# Altium project 24V-20A-Power-Board-v1.0.PrjPcb (part 2 of 5)
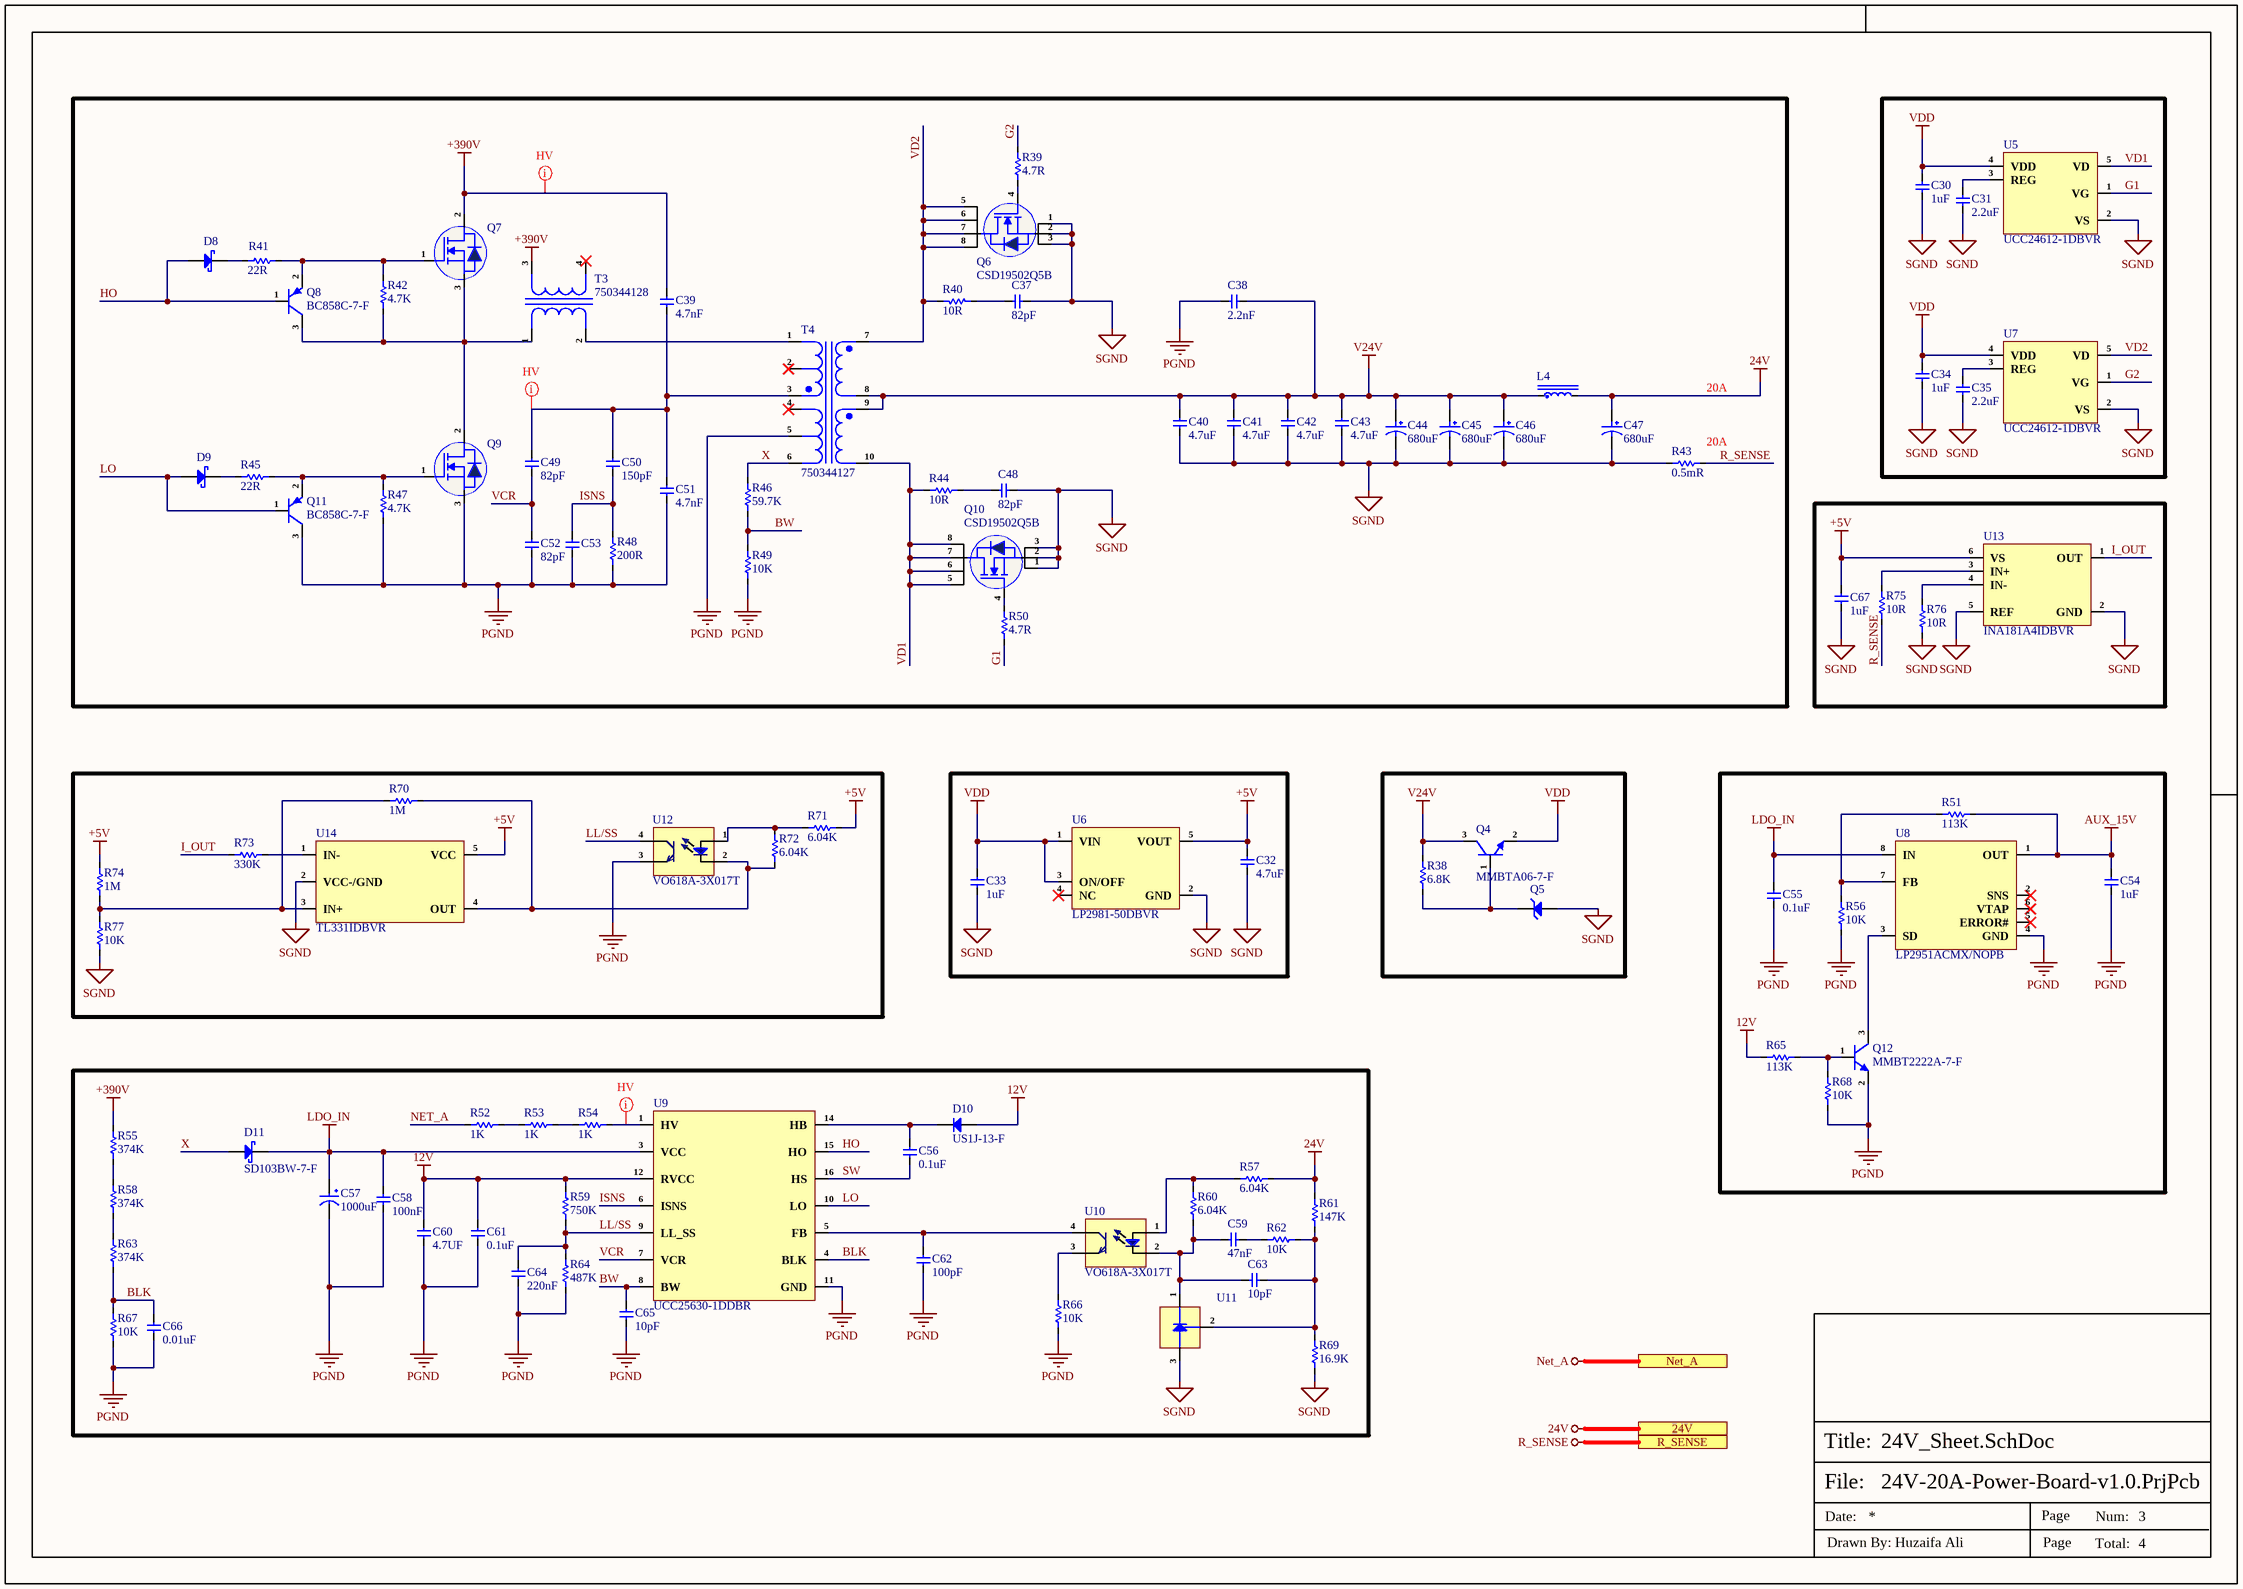
[diagram p4: 24V_Sheet.SchDoc]

## Sheet 24V_Sheet.SchDoc (continued)
### Library data of the parts
C30 C33 C34 C54 C67 = TCC0603X5R105M250CT: 1uF 25V X5R ±20% 0603 Multilayer Ceramic Capacitors MLCC - SMD/SMT ROHS; Manufacturer: CCTC; LCSC Part Number: C6266891; Manufacturer Part Number: TCC0603X5R105M250CT; Value: 1uF; Item Type: Capacitor; ComponentLink1Description: LCSC; ComponentLink1URL: https://www.lcsc.com/product-detail/Multilayer-Ceramic-Capacitors-MLCC-SMD-SMT_CCTC-TCC0603X5R105M250CT_C6266891.html
C31 C35 = GRM188R6YA225KA12D: CAP, 2.2µF, 35V, 10%, X5R, 0603; Manufacturer: Murata; Material: Ceramic; Item Type: Capacitor; Supplier 1: Digi-Key; Manufacturer Part Number: GRM188R6YA225KA12D; RoHS: Yes; Category: Ceramic Capacitors; Stock 1: 81665; Pricing 1: 1=0.21000, 10=0.14100, 50=0.08480, 100=0.07170, 500=0.04904, 1000=0.04338 (USD); Mount: Surface Mount; Case/Package: 0603; Case Code (Metric): 1608; Case Code (Imperial): 0603; Weight: 0.000222oz; Min Operating Temperature: -55°C; Max Operating Temperature: 85°C; Package Quantity: 4000; Packaging: Tape and Reel; Capacitance: 2.2uF; Tolerance: 10%; Voltage Rating: 35V; Dielectric: X5R; Voltage: 35V; Termination: SMD/SMT; Voltage Rating (DC): 35V; Series: GRM; Length: 1.6mm; Width: 0.8mm; Height: 0.8mm; Thickness: 0.035inch; Depth: 0.8mm; REACH SVHC: No SVHC; Lead Free: Lead Free; RoHS Compliant: Yes; ComponentLink1URL: https://datasheet.ciiva.com/14906/partnumbering-e-01-14906490.pdf?src-supplier=Digi-Key; ComponentLink1Description: https://datasheet.ciiva.com/14906/partnumbering-e-01-14906490.pdf?src-supplier=Digi-Key; ComponentLink2URL: https://datasheet.ciiva.com/14906/partnumbering-e-01-14906491.pdf?src-supplier=Digi-Key; ComponentLink2Description: https://datasheet.ciiva.com/14906/partnumbering-e-01-14906491.pdf?src-supplier=Digi-Key; ComponentLink3URL: https://datasheet.ciiva.com/14906/partnumbering-e-01-14906492.pdf?src-supplier=Digi-Key; ComponentLink3Description: https://datasheet.ciiva.com/14906/partnumbering-e-01-14906492.pdf?src-supplier=Digi-Key; Supplier Part Number 1: 490-7204-1-ND; LCSC Part Number: C86017
C32 = CC0603KRX5R7BB475: CAP CER 4.7UF 16V X5R 0603; Manufacturer: Yageo; Tolerance: 10%; Item Type: Capacitor; Supplier 1: Digi-Key; Manufacturer Part Number: CC0603KRX5R7BB475; RoHS: Yes; Category: Ceramic Capacitors; Stock 1: 547703; Pricing 1: 1=0.20000, 10=0.13800, 50=0.08280, 100=0.06990, 500=0.04784, 1000=0.04233 (USD); Mount: Surface Mount; Case/Package: 0603; Case Code (Imperial): 0603; Case Code (Metric): 1608; Weight: 7.1E-05oz; Min Operating Temperature: -55°C; Max Operating Temperature: 85°C; Capacitance: 4.7uF; Voltage Rating: 16V; Voltage Rating (DC): 16V; Packaging: Tape and Reel; Dielectric: X5R; Termination: SMD/SMT; Resistor Type: Ceramic; Series: CC; Length: 1.6mm; Width: 0.8mm; Height: 0.8mm; Thickness: 0.037inch; Depth: 0.8mm; Lead Free: Lead Free; Halogen Free: Halogen Free; RoHS Compliant: Yes; ComponentLink1URL: http://www.mouser.com/ds/2/447/UPY-GPHC_X5R_4V-to-50V_25-1131599.pdf?src-supplier=Mouser; ComponentLink1Description: http://www.mouser.com/ds/2/447/UPY-GPHC_X5R_4V-to-50V_25-1131599.pdf?src-supplier=Mouser; ComponentLink2URL: http://www.yageo.com/documents/recent/UPY-GPHC_X5R_4V-to-50V_25.pdf?src-supplier=Digi-Key; ComponentLink2Description: http://www.yageo.com/documents/recent/UPY-GPHC_X5R_4V-to-50V_25.pdf?src-supplier=Digi-Key; Supplier Part Number 1: 311-1785-1-ND; LCSC Part Number: C277476
C37 C48 C49 C52 = GCM31A7U3A820JX01D: CAP CER 82PF 1KV U2J 1206; Manufacturer: Murata; Item Type: Capacitors; Supplier: Digikey; LCSC Part Number: C5125804; Manufacturer Part Number: GCM31A7U3A820JX01D; RoHS: Yes; Pricing: 4000=0.07144 (USD)
C38 = KJKF222M2FF7035A075E: 2.2nF ±20% Y2 300V Plugin,P=7.5mm Safety Capacitors ROHS; Manufacturer: KNSCHA; Supplier: LCSC; LCSC Part Number: C2803195; Manufacturer Part Number: KJKF222M2FF7035A075E; RoHS: No; Item Type: Capacitor
C39 C51 = MMK472J3AC2KN206G0: 4.7nF -40℃~+105℃ ±5% 1kV Plugin,P=10mm Polypropylene Film Capacitors (CBB) ROHS; Manufacturer: KNSCHA; Manufacturer Part Number: MMK472J3AC2KN206G0; Package: Plugin,P=10mm; LCSC Part Number: C2998032; Item Type: Capacitor; ComponentLink1Description: LCSC; ComponentLink1URL: https://www.lcsc.com/product-detail/Polypropylene-Film-Capacitors-CBB_KNSCHA-MMK472J3AC2KN206G0_C2998032.html
C40-C43 = GRM31CC72A475KE11L: CAP CER 4.7UF 100V X7S 1206; Manufacturer: Murata; Item Type: Capacitor; Supplier 1: Arrow Electronics; Manufacturer Part Number: GRM31CC72A475KE11L; RoHS: Yes; Category: Ceramic Capacitors; Stock 1: 120000; Pricing 1: 2000=0.23470, 4000=0.21710, 10000=0.21040, 14000=0.20560 (USD); RoHS Compliant: Yes; ComponentLink1URL: https://search.murata.co.jp/Ceramy/image/img/A01X/G101/ENG/GRM31CC72A475KE11-01A.pdf?src-supplier=Digi-Key; ComponentLink1Description: https://search.murata.co.jp/Ceramy/image/img/A01X/G101/ENG/GRM31CC72A475KE11-01A.pdf?src-supplier=Digi-Key; Supplier Part Number 1: GRM31CC72A475KE11L; LCSC Part Number: C237304
C44-C47 = ERS1HM681W20OT: 680uF 50V ±20% Plugin,D12.5xL20mm Aluminum Electrolytic Capacitors - Leaded ROHS; Manufacturer: AISHI; Manufacturer Part Number: ERS1HM681W20OT; Package: Plugin,D12.5xL20mm; LCSC Part Number: C106668; Item Type: Capacitor; ComponentLink1Description: LCSC; ComponentLink1URL: https://www.lcsc.com/product-detail/Aluminum-Electrolytic-Capacitors-Leaded_AISHI-Aihua-Group-ERS1HM681W20OT_C106668.html
C50 = GRM31A7U3A151JW31D: CAP CER 150PF 1KV U2J 1206; Manufacturer: Murata; Item Type: Capacitors; Temperature Coefficient: -750ppm/°C; Supplier: Mouser; LCSC Part Number: C162467; Manufacturer Part Number: GRM31A7U3A151JW31D; RoHS: Yes; Stock: 15950; Pricing: 1=0.39, 10=0.191, 50=0.191, 100=0.123, 1000=0.098, 10000=0.085 (USD); ComponentLink1URL: https://datasheet.ciiva.com/16214/product-16214766.pdf?src-supplier=Future+Electronics; ComponentLink1Description: https://datasheet.ciiva.com/16214/product-16214766.pdf?src-supplier=Future+Electronics; ComponentLink2URL: https://datasheet.ciiva.com/139/partnumbering-e-01-139260.pdf?src-supplier=Digikey; ComponentLink2Description: https://datasheet.ciiva.com/139/partnumbering-e-01-139260.pdf?src-supplier=Digikey; ComponentLink3URL: https://datasheet.ciiva.com/139/partnumbering-e-01-139261.pdf?src-supplier=Digikey; ComponentLink3Description: https://datasheet.ciiva.com/139/partnumbering-e-01-139261.pdf?src-supplier=Digikey; ComponentLink4URL: https://datasheet.ciiva.com/139/partnumbering-e-01-139262.pdf?src-supplier=Digikey; ComponentLink4Description: https://datasheet.ciiva.com/139/partnumbering-e-01-139262.pdf?src-supplier=Digikey
C53 = RF15N3R3C500CT: CAP CER 3.3PF 50V C0G/NP0 0402; Manufacturer: Walsin Tech Corp; Item Type: Capacitor; Manufacturer Part Number: RF15N3R3C500CT; Package: 0402; LCSC Part Number: C172822; ComponentLink1Description: LCSC; ComponentLink1URL: https://www.lcsc.com/product-detail/Multilayer-Ceramic-Capacitors-MLCC-SMD-SMT_Walsin-Tech-Corp-RF15N3R3C500CT_C172822.html
C55 = GRM31C5C1H104FA01L: 50V 100nF C0G ±1% 1206 Multilayer Ceramic Capacitors MLCC - SMD/SMT ROHS; Manufacturer: Murata Electronics; LCSC Part Number: C2981728; Item Type: Capacitor; Manufacturer Part Number: GRM31C5C1H104FA01L; ComponentLink1Description: LCSC; ComponentLink1URL: https://www.lcsc.com/product-detail/Multilayer-Ceramic-Capacitors-MLCC-SMD-SMT_Murata-Electronics-GRM31C5C1H104FA01L_C2981728.html
C56 C61 = CC0805KKX7R0BB104: CAP CER 0.1UF 100V X7R 0805; Manufacturer: Yageo; Item Type: Capacitor; Tolerance: 10%; Value: 100nF; Supplier: Digikey; LCSC Part Number: C106243; Manufacturer Part Number: CC0805KKX7R0BB104; RoHS: Yes; Stock: 52345; Pricing: 1=0.19, 10=0.126, 50=0.0756, 100=0.0594, 500=0.0439, 1000=0.03634 (USD); Mounting Technology: Surface Mount; Case/Package: 0805; Case Code (Imperial): 0805; Case Code (Metric): 2012; Weight: 0.000194oz; Min Operating Temperature: -55°C; Max Operating Temperature: 125°C; Dielectric: X7R; Packaging: Tape and Reel; Voltage Rating (DC): 100V; Voltage Rating: 100V; Termination: SMD/SMT; Voltage: 100V; Series: CC; Lead Free: Lead Free; RoHS Compliant: Yes; ComponentLink1URL: https://media.digikey.com/pdf/Data%20Sheets/Yageo%20PDFs/NPO,%20X7R%20Mid-voltage.pdf?src-supplier=Digikey; ComponentLink1Description: https://media.digikey.com/pdf/Data%20Sheets/Yageo%20PDFs/NPO,%20X7R%20Mid-voltage.pdf?src-supplier=Digikey; ComponentLink2URL: http://www.mouser.com/ds/2/447/Yageo_UPY-GP_NP0_16V-to-50V_9-358835.pdf?src-supplier=Mouser; ComponentLink2Description: http://www.mouser.com/ds/2/447/Yageo_UPY-GP_NP0_16V-to-50V_9-358835.pdf?src-supplier=Mouser; ComponentLink3URL: http://www.yageo.com/documents/recent/UPY-NP0X7R_MV_100-to-630V_21.pdf?src-supplier=Digikey; ComponentLink3Description: http://www.yageo.com/documents/recent/UPY-NP0X7R_MV_100-to-630V_21.pdf?src-supplier=Digikey; ComponentLink4URL: https://datasheet.octopart.com/CC0805KKX7R0BB104-Yageo-datasheet-101324229.pdf?src-supplier=Newark; ComponentLink4Description: https://datasheet.octopart.com/CC0805KKX7R0BB104-Yageo-datasheet-101324229.pdf?src-supplier=Newark; ComponentLink5URL: https://datasheet.octopart.com/CC0805KKX7R0BB104-Yageo-datasheet-166511530.pdf?src-supplier=Future+Electronics; ComponentLink5Description: https://datasheet.octopart.com/CC0805KKX7R0BB104-Yageo-datasheet-166511530.pdf?src-supplier=Future+Electronics
C57 = VZH102M1HTR-1616CS: 1000uF 50V ±20% SMD,D16xL16.5mm Aluminum Electrolytic Capacitors - SMD ROHS; Manufacturer: Surge Components; Supplier: Future Electronics; LCSC Part Number: C5266058; Manufacturer Part Number: VZH102M1HTR-1616CS; RoHS: No; Stock: 600; Pricing: 200=0.675, 600=0.645, 800=0.64, 2000=0.62, 3000=0.6 (USD); Item Type: Capacitors
C58 = CC0603KRX5R9BB104: CAP CER 0.1UF 50V X5R 0603; Manufacturer: Yageo; Tolerance: 10%; Item Type: Capacitor; Supplier 1: Digi-Key; Manufacturer Part Number: CC0603KRX5R9BB104; RoHS: Yes; Category: Ceramic Capacitors; Stock 1: 152253; Pricing 1: 1=0.10000, 10=0.05200, 50=0.02820, 100=0.02310, 500=0.01648, 1000=0.01294 (USD); Mount: Surface Mount; Case/Package: 0603; Case Code (Imperial): 0603; Case Code (Metric): 1608; Weight: 7.1E-05oz; Min Operating Temperature: -55°C; Max Operating Temperature: 85°C; Capacitance: 100nF; Packaging: Tape and Reel; Voltage Rating: 50V; Dielectric: X5R; Termination: SMD/SMT; Voltage Rating (DC): 50V; Package Quantity: 4000; Length: 0.063inch; Width: 0.031inch; Thickness: 0.035inch; Lead Free: Lead Free; Halogen Free: Halogen Free; ComponentLink1URL: http://www.mouser.com/ds/2/447/Yageo_UPY-GP_NP0_16V-to-50V_9-358835.pdf?src-supplier=Mouser; ComponentLink1Description: http://www.mouser.com/ds/2/447/Yageo_UPY-GP_NP0_16V-to-50V_9-358835.pdf?src-supplier=Mouser; ComponentLink2URL: https://www.yageo.com/upload/media/product/productsearch/datasheet/mlcc/UPY-GPHC_X5R_4V-to-50V_26.pdf?src-supplier=Digi-Key; ComponentLink2Description: https://www.yageo.com/upload/media/product/productsearch/datasheet/mlcc/UPY-GPHC_X5R_4V-to-50V_26.pdf?src-supplier=Digi-Key; ComponentLink3URL: http://www.yageo.com/exep/pages/download/literatures/ProductSelectionGuide%202014_Final_2.pdf?src-supplier=Digi-Key; ComponentLink3Description: http://www.yageo.com/exep/pages/download/literatures/ProductSelectionGuide%202014_Final_2.pdf?src-supplier=Digi-Key; Supplier Part Number 1: 311-4046-1-ND; LCSC Part Number: C110022
C59 = GRM155R71E473KA88D: CAP CER 0.047UF 25V X7R 0402; Manufacturer: Murata; Material: Ceramic; Tolerance: 10%; Item Type: Capacitor; Supplier 1: Rs; Manufacturer Part Number: GRM155R71E473KA88D; RoHS: Yes; Category: Ceramic Capacitors; Stock 1: 10000; Pricing 1: 1000=0.00007, 8000=0.00900 (GBP); Mounting Technology: Surface Mount; Case/Package: 0402; Pins: 2; Case Code (Metric): 1005; Case Code (Imperial): 0402; Min Operating Temperature: -55°C; Max Operating Temperature: 125°C; Value: 47nF; Dielectric: X7R; Package Quantity: 1; Voltage Rating: 25V; Packaging: Tape and Reel; Termination: SMD/SMT; Voltage: 25V; Voltage Rating (DC): 25V; Series: GRM; Construction: Flat; Length: 1mm; Width: 0.02inch; Height: 0.5mm; Thickness: 0.022inch; Depth: 0.5mm; Radiation Hardening: No; Reach SVHC Compliant: Yes; Lead Free: Lead Free; RoHS Compliant: Yes; ComponentLink1URL: https://datasheet.ciiva.com/34302/1856425-34302854.pdf?src-supplier=Jameco; ComponentLink1Description: https://datasheet.ciiva.com/34302/1856425-34302854.pdf?src-supplier=Jameco; ComponentLink2URL: https://datasheet.ciiva.com/131/grm155r71e473ka88-01-131494.pdf?src-supplier=Digi-Key; ComponentLink2Description: https://datasheet.ciiva.com/131/grm155r71e473ka88-01-131494.pdf?src-supplier=Digi-Key; ComponentLink3URL: https://datasheet.ciiva.com/18184/getdatasheetpartid-153136-18184712.pdf?src-supplier=Verical; ComponentLink3Description: https://datasheet.ciiva.com/18184/getdatasheetpartid-153136-18184712.pdf?src-supplier=Verical; ComponentLink4URL: https://datasheet.ciiva.com/29199/454180-da-01-en-vs-kondensator-0402-29199826.pdf?src-supplier=Conrad; ComponentLink4Description: https://datasheet.ciiva.com/29199/454180-da-01-en-vs-kondensator-0402-29199826.pdf?src-supplier=Conrad; ComponentLink5URL: https://datasheet.ciiva.com/14103/grmseries-highdielectrictype-eng-14103754.pdf?src-supplier=Distrelec; ComponentLink5Description: https://datasheet.ciiva.com/14103/grmseries-highdielectrictype-eng-14103754.pdf?src-supplier=Distrelec; ComponentLink6URL: https://datasheet.ciiva.com/7937/608985-7937623.pdf?src-supplier=Element14; ComponentLink6Description: https://datasheet.ciiva.com/7937/608985-7937623.pdf?src-supplier=Element14; ComponentLink7URL: https://datasheet.ciiva.com/131/grm155r71e473ka88-01-131493.pdf?src-supplier=Digi-Key; ComponentLink7Description: https://datasheet.ciiva.com/131/grm155r71e473ka88-01-131493.pdf?src-supplier=Digi-Key; ComponentLink8URL: https://datasheet.ciiva.com/131/grm155r71e473ka88-01-131492.pdf?src-supplier=Digi-Key; ComponentLink8Description: https://datasheet.ciiva.com/131/grm155r71e473ka88-01-131492.pdf?src-supplier=Digi-Key; ComponentLink9URL: https://datasheet.ciiva.com/5424/product-5424844.pdf?src-supplier=Mouser; ComponentLink9Description: https://datasheet.ciiva.com/5424/product-5424844.pdf?src-supplier=Mouser; ComponentLink10URL: https://datasheet.ciiva.com/2989/product-2989395.pdf?src-supplier=Avnet; ComponentLink10Description: https://datasheet.ciiva.com/2989/product-2989395.pdf?src-supplier=Avnet; ComponentLink11URL: https://datasheet.ciiva.com/16213/product-16213823.pdf?src-supplier=Future+Electronics; ComponentLink11Description: https://datasheet.ciiva.com/16213/product-16213823.pdf?src-supplier=Future+Electronics; Supplier Part Number 1: 2478015P; LCSC Part Number: C77017
C60 = CL10A475KA8NQNC: CAP CER 4.7UF 25V X5R 0603; Manufacturer: Samsung; Tolerance: 10%; Supplier 1: Digi-Key; Manufacturer Part Number: CL10A475KA8NQNC; Stock 1: 2252340; Pricing 1: 1=0.37, 10=0.255, 100=0.1528, 500=0.11456, 1000=0.09675 (USD); Mount: Surface Mount; Case/Package: 0603; Case Code (Metric): 1608; Case Code (Imperial): 0603; Contact Plating: Tin; Min Operating Temperature: -55°C; Max Operating Temperature: 85°C; Package Quantity: 1; Packaging: Tape and Reel; Capacitance: 4.7uF; Voltage Rating: 25V; Dielectric: X5R; Termination: Wraparound; Length: 1.6mm; Width: 0.031inch; Thickness: 0.035inch; Depth: 0.8mm; Lead Free: Lead Free; ComponentLink1URL: http://www.samsungsem.com/kr/support/product-search/mlcc/CL10A475KA8NQNC.jsp?src-supplier=Digi-Key; ComponentLink1Description: http://www.samsungsem.com/kr/support/product-search/mlcc/CL10A475KA8NQNC.jsp?src-supplier=Digi-Key; Supplier Part Number 1: 1276-1900-1-ND; LCSC Part Number: C69335
C62 = CC0603JRNPO9BN101: CAP CER 100PF 50V C0G/NPO 0603; Manufacturer: Yageo; Tolerance: 5%; Dielectric: C0G; Temperature Coefficient: 30ppm/°C; Insulation Resistance: 100GR; Supplier 1: Arrow Electronics; Manufacturer Part Number: CC0603JRNPO9BN101; RoHS: Yes; Category: Ceramic Capacitors; Stock 1: 10744; Pricing 1: 1=0.06030, 10=0.04400, 25=0.02170, 100=0.01580, 250=0.01330, 500=0.01300, 1000=0.01150, 3000=0.01010, 6000=0.00680 (USD); Mount: Surface Mount; Case/Package: 0603; Number of Pins: 2; Case Code (Imperial): 0603; Case Code (Metric): 1608; Min Operating Temperature: -55°C; Max Operating Temperature: 125°C; Capacitance: 100pF; Voltage: 50V; Voltage Rating: 50V; Voltage Rating (DC): 50V; Packaging: Tape and Reel; Package Quantity: 1; Termination: SMD/SMT; Resistor Type: Ceramic; Series: CC; Length: 1.6mm; Width: 0.8mm; Height: 0.8mm; Thickness: 0.035inch; Depth: 0.8mm; Radiation Hardening: No; RoHS Compliant: Yes; REACH SVHC: Unknown; Lead Free: Lead Free; ComponentLink1URL: https://datasheet.ciiva.com/11786/0900766b8079c870-11786060.pdf?src-supplier=RSComponents; ComponentLink1Description: https://datasheet.ciiva.com/11786/0900766b8079c870-11786060.pdf?src-supplier=RSComponents; ComponentLink2URL: https://datasheet.ciiva.com/7978/1443161-7978127.pdf?src-supplier=Element14; ComponentLink2Description: https://datasheet.ciiva.com/7978/1443161-7978127.pdf?src-supplier=Element14; ComponentLink3URL: https://datasheet.ciiva.com/28450/1443161-28450457.pdf?src-supplier=Element14; ComponentLink3Description: https://datasheet.ciiva.com/28450/1443161-28450457.pdf?src-supplier=Element14; ComponentLink4URL: https://datasheet.ciiva.com/46430/1835847-46430151.pdf?src-supplier=Element14; ComponentLink4Description: https://datasheet.ciiva.com/46430/1835847-46430151.pdf?src-supplier=Element14; ComponentLink5URL: https://datasheet.ciiva.com/144/mlccorderingcode-144629.pdf?src-supplier=Digi-Key; ComponentLink5Description: https://datasheet.ciiva.com/144/mlccorderingcode-144629.pdf?src-supplier=Digi-Key; ComponentLink6URL: https://datasheet.ciiva.com/144/mlccorderingcode-144628.pdf?src-supplier=Digi-Key; ComponentLink6Description: https://datasheet.ciiva.com/144/mlccorderingcode-144628.pdf?src-supplier=Digi-Key; ComponentLink7URL: https://datasheet.ciiva.com/144/mlccorderingcode-144630.pdf?src-supplier=Digi-Key; ComponentLink7Description: https://datasheet.ciiva.com/144/mlccorderingcode-144630.pdf?src-supplier=Digi-Key; ComponentLink8URL: https://datasheet.ciiva.com/11464/upy-gp-np0-16v-to-50v-8-11464725.pdf?src-supplier=Avnet; ComponentLink8Description: https://datasheet.ciiva.com/11464/upy-gp-np0-16v-to-50v-8-11464725.pdf?src-supplier=Avnet; ComponentLink9URL: https://datasheet.ciiva.com/26829/getdatasheetpartid-403525-26829372.pdf?src-supplier=Verical; ComponentLink9Description: https://datasheet.ciiva.com/26829/getdatasheetpartid-403525-26829372.pdf?src-supplier=Verical; Supplier Part Number 1: CC0603JRNPO9BN101; LCSC Part Number: C14665
C63 C65 = CC0603JRNPO9BN100: CAP CER 10PF 50V C0G/NPO 0603; Manufacturer: Yageo; Tolerance: 5%; Dielectric: C0G; Temperature Coefficient: 30ppm/°C; Insulation Resistance: 100GR; ComponentLink1URL: https://datasheet.ciiva.com/25787/cl10a475ka8nqnc-25787017.pdf?src-supplier=Digi-Key; ComponentLink1Description: https://datasheet.ciiva.com/25787/cl10a475ka8nqnc-25787017.pdf?src-supplier=Digi-Key; ComponentLink2URL: https://datasheet.ciiva.com/144/mlccorderingcode-144651.pdf?src-supplier=Digi-Key; ComponentLink2Description: https://datasheet.ciiva.com/144/mlccorderingcode-144651.pdf?src-supplier=Digi-Key; ComponentLink3URL: https://datasheet.ciiva.com/11786/0900766b8079c870-11786407.pdf?src-supplier=RSComponents; ComponentLink3Description: https://datasheet.ciiva.com/11786/0900766b8079c870-11786407.pdf?src-supplier=RSComponents; ComponentLink4URL: https://datasheet.ciiva.com/5789/1734582-5789616.pdf?src-supplier=Farnell; ComponentLink4Description: https://datasheet.ciiva.com/5789/1734582-5789616.pdf?src-supplier=Farnell; ComponentLink5URL: https://datasheet.ciiva.com/26862/getdatasheetpartid-403524-26862758.pdf?src-supplier=Verical; ComponentLink5Description: https://datasheet.ciiva.com/26862/getdatasheetpartid-403524-26862758.pdf?src-supplier=Verical; ComponentLink6URL: https://datasheet.ciiva.com/7978/1132289-7978126.pdf?src-supplier=Element14; ComponentLink6Description: https://datasheet.ciiva.com/7978/1132289-7978126.pdf?src-supplier=Element14; ComponentLink7URL: https://datasheet.ciiva.com/46430/1835847-46430150.pdf?src-supplier=Element14; ComponentLink7Description: https://datasheet.ciiva.com/46430/1835847-46430150.pdf?src-supplier=Element14; ComponentLink8URL: https://datasheet.ciiva.com/144/mlccorderingcode-144650.pdf?src-supplier=Digi-Key; ComponentLink8Description: https://datasheet.ciiva.com/144/mlccorderingcode-144650.pdf?src-supplier=Digi-Key; ComponentLink9URL: https://datasheet.ciiva.com/144/mlccorderingcode-144649.pdf?src-supplier=Digi-Key; ComponentLink9Description: https://datasheet.ciiva.com/144/mlccorderingcode-144649.pdf?src-supplier=Digi-Key; ComponentLink10URL: https://datasheet.ciiva.com/5425/upy-gp-np0-16v-to-50v-8-5425564.pdf?src-supplier=Mouser; ComponentLink10Description: https://datasheet.ciiva.com/5425/upy-gp-np0-16v-to-50v-8-5425564.pdf?src-supplier=Mouser; ComponentLink11URL: https://datasheet.ciiva.com/8033/1734582-8033710.pdf?src-supplier=Element14; ComponentLink11Description: https://datasheet.ciiva.com/8033/1734582-8033710.pdf?src-supplier=Element14; ComponentLink12URL: https://datasheet.ciiva.com/8033/1734582-8033706.pdf?src-supplier=Element14; ComponentLink12Description: https://datasheet.ciiva.com/8033/1734582-8033706.pdf?src-supplier=Element14; Supplier 1: Digi-Key; Manufacturer Part Number: CC0603JRNPO9BN100; RoHS: Yes; Category: Ceramic Capacitors; Stock 1: 1700978; Pricing 1: 1=0.10000, 10=0.03900, 50=0.02120, 100=0.01740, 500=0.01240, 1000=0.00974 (USD); Mount: Surface Mount; Case/Package: 0603; Number of Pins: 2; Case Code (Metric): 1608; Case Code (Imperial): 0603; Min Operating Temperature: -55°C; Max Operating Temperature: 125°C; Capacitance: 10pF; Voltage: 50V; Voltage Rating: 50V; Voltage Rating (DC): 50V; Packaging: Tape and Reel; Package Quantity: 1; Termination: SMD/SMT; Resistor Type: Ceramic; Series: CC; Length: 1.6mm; Width: 0.031inch; Height: 0.8mm; Thickness: 0.035inch; Depth: 0.8mm; Radiation Hardening: No; RoHS Compliant: Yes; REACH SVHC: No SVHC; Lead Free: Lead Free; Supplier Part Number 1: 311-1058-1-ND; LCSC Part Number: C106245
C64 = CC1206JKX7R9BB224: CAP CER 0.22UF 50V X7R 1206; Manufacturer: Yageo; Item Type: Capacitor; Supplier: Future Electronics; Supplier Part Number: 4639209; Manufacturer Part Number: CC1206JKX7R9BB224; RoHS: Yes; Category: Ceramic Capacitors; Stock: 3000; Pricing: 3000=0.0381, 9000=0.0366, 15000=0.036, 30000=0.0351, 60000=0.0337 (USD); ComponentLink1URL: https://datasheet.ciiva.com/13210/upy-gp-np0-16v-to-50v-8-13210060.pdf?src-supplier=Mouser; ComponentLink1Description: https://datasheet.ciiva.com/13210/upy-gp-np0-16v-to-50v-8-13210060.pdf?src-supplier=Mouser; ComponentLink2URL: https://datasheet.ciiva.com/11466/upy-gphc-x7r-6-3v-to-50v-8-11466351.pdf?src-supplier=Avnet; ComponentLink2Description: https://datasheet.ciiva.com/11466/upy-gphc-x7r-6-3v-to-50v-8-11466351.pdf?src-supplier=Avnet; LCSC Part Number: C527274
C66 = CC0805KRX7R9BB103: Multilayer Ceramic Capacitor, 0.01 uF, 50 V, ± 10%, X7R, 0805 [2012 Metric]; Manufacturer: Yageo; Value: 10nF; Voltage: 50V; Insulation Resistance: 100GR; Supplier: Digikey; Supplier Part Number: 311-1136-1-ND; Manufacturer Part Number: CC0805KRX7R9BB103; RoHS: Yes; Category: Ceramic Capacitors; Stock: 792242; Pricing: 1=0.1, 10=0.058, 50=0.0334, 100=0.0258, 500=0.01944, 1000=0.01528 (USD); Mounting Technology: Surface Mount; Case/Package: 0805; Pins: 2; Material: Ceramic; Case Code (Imperial): 0805; Case Code (Metric): 2012; Min Operating Temperature: -55°C; Max Operating Temperature: 125°C; Tolerance: 10%; Dielectric: X7R; Packaging: Tape and Reel; Voltage Rating: 50V; Package Quantity: 4000; Voltage Rating (DC): 50V; Termination: SMD/SMT; Series: CC; Length: 2mm; Width: 1.25mm; Height: 0.6mm; Depth: 1.25mm; Radiation Hardening: No; RoHS Compliant: Yes; Reach SVHC Compliant: No; Halogen Free: 5694HalogenFree; Lead Free: 5697LeadFree; ComponentLink1URL: https://datasheet.ciiva.com/25613/0900766b8027bcf6-25613113.pdf?src-supplier=Rs; ComponentLink1Description: https://datasheet.ciiva.com/25613/0900766b8027bcf6-25613113.pdf?src-supplier=Rs; ComponentLink2URL: https://datasheet.ciiva.com/11786/0900766b80d84f1d-11786119.pdf?src-supplier=Rs; ComponentLink2Description: https://datasheet.ciiva.com/11786/0900766b80d84f1d-11786119.pdf?src-supplier=Rs; ComponentLink3URL: https://datasheet.ciiva.com/22749/1489800-22749215.pdf?src-supplier=Element14; ComponentLink3Description: https://datasheet.ciiva.com/22749/1489800-22749215.pdf?src-supplier=Element14; ComponentLink4URL: https://datasheet.ciiva.com/46372/1734573-46372639.pdf?src-supplier=Element14; ComponentLink4Description: https://datasheet.ciiva.com/46372/1734573-46372639.pdf?src-supplier=Element14; ComponentLink5URL: https://datasheet.ciiva.com/46372/1784427-46372638.pdf?src-supplier=Element14; ComponentLink5Description: https://datasheet.ciiva.com/46372/1784427-46372638.pdf?src-supplier=Element14; ComponentLink6URL: https://datasheet.ciiva.com/144/mlccorderingcode-144533.pdf?src-supplier=Digikey; ComponentLink6Description: https://datasheet.ciiva.com/144/mlccorderingcode-144533.pdf?src-supplier=Digikey; ComponentLink7URL: https://datasheet.ciiva.com/144/mlccorderingcode-144532.pdf?src-supplier=Digikey; ComponentLink7Description: https://datasheet.ciiva.com/144/mlccorderingcode-144532.pdf?src-supplier=Digikey; ComponentLink8URL: https://datasheet.ciiva.com/144/mlccorderingcode-144534.pdf?src-supplier=Digikey; ComponentLink8Description: https://datasheet.ciiva.com/144/mlccorderingcode-144534.pdf?src-supplier=Digikey; Item Type: Capacitor; Package: 0805
D8 D9 D11 = SD103BW-7-F: DIODE SCHOTTKY 30V 350MA SOD123; Manufacturer: Diodes; Supplier: Future Electronics; LCSC Part Number: C151400; Manufacturer Part Number: SD103BW-7-F; RoHS: Yes; Item Type: Diodes; Stock: 6000; Pricing: 3000=0.0438, 9000=0.0421, 12000=0.0416, 30000=0.0403, 45000=0.039 (USD); ComponentLink1URL: https://datasheet.ciiva.com/36526/1541925-36526008.pdf?src-supplier=Jameco; ComponentLink1Description: https://datasheet.ciiva.com/36526/1541925-36526008.pdf?src-supplier=Jameco; ComponentLink2URL: https://datasheet.ciiva.com/22695/480042-22695847.pdf?src-supplier=Element14; ComponentLink2Description: https://datasheet.ciiva.com/22695/480042-22695847.pdf?src-supplier=Element14; ComponentLink3URL: https://datasheet.ciiva.com/7964/ds11013-7964329.pdf?src-supplier=Element14; ComponentLink3Description: https://datasheet.ciiva.com/7964/ds11013-7964329.pdf?src-supplier=Element14; ComponentLink4URL: https://datasheet.ciiva.com/912/ds11013-912934.pdf?src-supplier=Digikey; ComponentLink4Description: https://datasheet.ciiva.com/912/ds11013-912934.pdf?src-supplier=Digikey; ComponentLink5URL: https://datasheet.ciiva.com/912/ds11013-912935.pdf?src-supplier=Digikey; ComponentLink5Description: https://datasheet.ciiva.com/912/ds11013-912935.pdf?src-supplier=Digikey
D10 = US1J-13-F: DIODE GEN PURP 600V 1A SMA; Manufacturer: Diodes; Supplier: Future Electronics; LCSC Part Number: C85095; Manufacturer Part Number: US1J-13-F; RoHS: Yes; Item Type: Diodes; Stock: 840000; Pricing: 5000=0.0426, 10000=0.0416, 15000=0.041, 25000=0.0402, 50000=0.0387 (USD); ComponentLink1URL: https://datasheet.ciiva.com/8053/ds16008-8053516.pdf?src-supplier=Element14; ComponentLink1Description: https://datasheet.ciiva.com/8053/ds16008-8053516.pdf?src-supplier=Element14; ComponentLink2URL: https://datasheet.ciiva.com/22695/1906610-22695290.pdf?src-supplier=Element14; ComponentLink2Description: https://datasheet.ciiva.com/22695/1906610-22695290.pdf?src-supplier=Element14; ComponentLink3URL: https://datasheet.ciiva.com/8301/ds16008-8301310.pdf?src-supplier=Avnet; ComponentLink3Description: https://datasheet.ciiva.com/8301/ds16008-8301310.pdf?src-supplier=Avnet; ComponentLink4URL: https://datasheet.ciiva.com/913/ds16008-913197.pdf?src-supplier=Digikey; ComponentLink4Description: https://datasheet.ciiva.com/913/ds16008-913197.pdf?src-supplier=Digikey; ComponentLink5URL: https://datasheet.ciiva.com/913/ds16008-913198.pdf?src-supplier=Digikey; ComponentLink5Description: https://datasheet.ciiva.com/913/ds16008-913198.pdf?src-supplier=Digikey; ComponentLink6URL: https://datasheet.ciiva.com/913/ds16008-913199.pdf?src-supplier=Digikey; ComponentLink6Description: https://datasheet.ciiva.com/913/ds16008-913199.pdf?src-supplier=Digikey
L4 = PA2607.301NLT: FIXED IND 300NH 27A 0.29MOHM SMD; Manufacturer: Pulse; Item Type: Inductor; Supplier: Mouser; Supplier Part Number: 673-PA2607.301NLT; Manufacturer Part Number: PA2607.301NLT; RoHS: Yes; Stock: 205; Pricing: 1=1.69, 10=1.19, 50=1.19, 100=0.956, 1000=0.796, 10000=0.795 (USD); ComponentLink1URL: https://datasheet.ciiva.com/15023/+p673-15023974.pdf?src-supplier=Digikey; ComponentLink1Description: https://datasheet.ciiva.com/15023/+p673-15023974.pdf?src-supplier=Digikey; ComponentLink2URL: https://datasheet.ciiva.com/15023/+p673-15023975.pdf?src-supplier=Digikey; ComponentLink2Description: https://datasheet.ciiva.com/15023/+p673-15023975.pdf?src-supplier=Digikey; ComponentLink3URL: https://datasheet.ciiva.com/15023/+p673-15023976.pdf?src-supplier=Digikey; ComponentLink3Description: https://datasheet.ciiva.com/15023/+p673-15023976.pdf?src-supplier=Digikey; ComponentLink4URL: https://datasheet.ciiva.com/8499/+p673-8499369.pdf?src-supplier=Avnet; ComponentLink4Description: https://datasheet.ciiva.com/8499/+p673-8499369.pdf?src-supplier=Avnet
Q4 = MMBTA06-7-F: TRANS NPN 80V 0.5A SOT23-3; Manufacturer: Diodes; Item Type: BJTs; Current Rating: 500mA; Supplier: Future Electronics; Supplier Part Number: 2136300; Manufacturer Part Number: MMBTA06-7-F; RoHS: Yes; Stock: 573000; Pricing: 3000=0.021, 9000=0.0202, 30000=0.0194, 60000=0.019, 120000=0.0182 (USD); Voltage Rating (DC): 80V; Lead Free: 5697LeadFree; ComponentLink1URL: https://datasheet.ciiva.com/19482/1540800-19482686.pdf?src-supplier=Jameco; ComponentLink1Description: https://datasheet.ciiva.com/19482/1540800-19482686.pdf?src-supplier=Jameco; ComponentLink2URL: https://datasheet.ciiva.com/15139/getdatasheetpartid-116057-15139325.pdf?src-supplier=Verical; ComponentLink2Description: https://datasheet.ciiva.com/15139/getdatasheetpartid-116057-15139325.pdf?src-supplier=Verical; ComponentLink3URL: https://datasheet.ciiva.com/972/ds30037-972971.pdf?src-supplier=Digikey; ComponentLink3Description: https://datasheet.ciiva.com/972/ds30037-972971.pdf?src-supplier=Digikey; ComponentLink4URL: https://datasheet.ciiva.com/972/ds30037-972972.pdf?src-supplier=Digikey; ComponentLink4Description: https://datasheet.ciiva.com/972/ds30037-972972.pdf?src-supplier=Digikey; ComponentLink5URL: https://datasheet.ciiva.com/972/ds30037-972973.pdf?src-supplier=Digikey; ComponentLink5Description: https://datasheet.ciiva.com/972/ds30037-972973.pdf?src-supplier=Digikey; ComponentLink6URL: https://datasheet.ciiva.com/11197/ds30037-11197413.pdf?src-supplier=Avnet; ComponentLink6Description: https://datasheet.ciiva.com/11197/ds30037-11197413.pdf?src-supplier=Avnet; ComponentLink7URL: https://datasheet.ciiva.com/4723/ds30037-4723212.pdf?src-supplier=Mouser; ComponentLink7Description: https://datasheet.ciiva.com/4723/ds30037-4723212.pdf?src-supplier=Mouser; ComponentLink8URL: https://datasheet.ciiva.com/22711/1915521-22711756.pdf?src-supplier=Element14; ComponentLink8Description: https://datasheet.ciiva.com/22711/1915521-22711756.pdf?src-supplier=Element14; ComponentLink9URL: https://datasheet.ciiva.com/16298/ds30037-16298441.pdf?src-supplier=Future+Electronics; ComponentLink9Description: https://datasheet.ciiva.com/16298/ds30037-16298441.pdf?src-supplier=Future+Electronics
Q5 = BZX384-C15,115: DIODE ZENER 15V 300MW SOD323; Manufacturer: Nexperia; Item Type: Diodes; Polarity: 5054Direction; Supplier: Future Electronics; LCSC Part Number: C454989; Manufacturer Part Number: BZX384-C15,115; RoHS: Yes; Stock: 1776000; Pricing: 3000=0.0151, 9000=0.0145, 30000=0.014, 60000=0.0137, 120000=0.0131 (USD); Pins: 2NUMBER; RoHS Compliant: Yes; ComponentLink1URL: https://datasheet.octopart.com/BZX384-C15%2C115-Nexperia-datasheet-155662751.pdf?src-supplier=Future+Electronics; ComponentLink1Description: https://datasheet.octopart.com/BZX384-C15%2C115-Nexperia-datasheet-155662751.pdf?src-supplier=Future+Electronics; ComponentLink2URL: https://assets.nexperia.com/documents/data-sheet/BZX384_SERIES.pdf?src-supplier=Digikey; ComponentLink2Description: https://assets.nexperia.com/documents/data-sheet/BZX384_SERIES.pdf?src-supplier=Digikey; ComponentLink3URL: https://datasheet.octopart.com/BZX384-C15%2C115-NXP-Semiconductors-datasheet-10084396.pdf?src-supplier=Element14; ComponentLink3Description: https://datasheet.octopart.com/BZX384-C15%2C115-NXP-Semiconductors-datasheet-10084396.pdf?src-supplier=Element14; ComponentLink4URL: https://datasheet.octopart.com/BZX384-C15%2C115-Nexperia-datasheet-8360268.pdf?src-supplier=Farnell; ComponentLink4Description: https://datasheet.octopart.com/BZX384-C15%2C115-Nexperia-datasheet-8360268.pdf?src-supplier=Farnell; ComponentLink5URL: https://datasheet.octopart.com/BZX384-C15%2C115-Nexperia-datasheet-68321567.pdf?src-supplier=Newark; ComponentLink5Description: https://datasheet.octopart.com/BZX384-C15%2C115-Nexperia-datasheet-68321567.pdf?src-supplier=Newark; ComponentLink6URL: https://datasheet.octopart.com/BZX384-C15%2C115-Nexperia-datasheet-105678879.pdf?src-supplier=TME; ComponentLink6Description: https://datasheet.octopart.com/BZX384-C15%2C115-Nexperia-datasheet-105678879.pdf?src-supplier=TME
Q6 Q10 = CSD19502Q5B: MOSFET N-CH 80V 100A 8VSON; Manufacturer: Texas Instruments; Manufacturer Part Number: CSD19502Q5B; Package: 8-VSON-CLIP (5x6); LCSC Part Number: C2864118; Item Type: Mosfet; ComponentLink1Description: LCSC; ComponentLink1URL: https://jlcpcb.com/partdetail/TexasInstruments-CSD19502Q5B/C2864118
Q7 Q9 = IPA60R120P7XKSA1: MOSFET N-CH 600V 26A TO220; Manufacturer: Infineon; Item Type: MOSFETs; Drain to Source Resistance: 100mR; Gate to Source Voltage (Vgs): 20V; Number of Channels: 1NUMBER; On-State Resistance: 120mR; Power Dissipation: 28W; Turn-Off Delay Time: 81ns; Turn-On Delay Time: 21ns; Supplier: Mouser; Supplier Part Number: 726-IPA60R120P7XKSA1; Manufacturer Part Number: IPA60R120P7XKSA1; RoHS: Yes; Stock: 2795; Pricing: 1=2.99, 10=2.59, 50=2.37, 100=2.03, 1000=1.59, 10000=1.39 (USD); Drain to Source Breakdown Voltage: 600V; Package Quantity: 500NUMBER; Height: 18.1mm; ComponentLink1URL: http://datasheet.octopart.com/IPA60R120P7XKSA1-Infineon-datasheet-96908606.pdf?src-supplier=Future+Electronics; ComponentLink1Description: http://datasheet.octopart.com/IPA60R120P7XKSA1-Infineon-datasheet-96908606.pdf?src-supplier=Future+Electronics; ComponentLink2URL: http://datasheet.octopart.com/IPA60R120P7XKSA1-Infineon-datasheet-96908606.pdf?src-supplier=Digikey; ComponentLink2Description: http://datasheet.octopart.com/IPA60R120P7XKSA1-Infineon-datasheet-96908606.pdf?src-supplier=Digikey; ComponentLink3URL: http://datasheet.octopart.com/IPA60R120P7XKSA1-Infineon-datasheet-96908606.pdf?src-supplier=Farnell; ComponentLink3Description: http://datasheet.octopart.com/IPA60R120P7XKSA1-Infineon-datasheet-96908606.pdf?src-supplier=Farnell; ComponentLink4URL: http://datasheet.octopart.com/IPA60R120P7XKSA1-Infineon-datasheet-96908606.pdf?src-supplier=Newark; ComponentLink4Description: http://datasheet.octopart.com/IPA60R120P7XKSA1-Infineon-datasheet-96908606.pdf?src-supplier=Newark; ComponentLink5URL: http://datasheet.octopart.com/IPA60R120P7XKSA1-Infineon-datasheet-96908606.pdf?src-supplier=Avnet; ComponentLink5Description: http://datasheet.octopart.com/IPA60R120P7XKSA1-Infineon-datasheet-96908606.pdf?src-supplier=Avnet; ComponentLink6URL: http://datasheet.octopart.com/IPA60R120P7XKSA1-Infineon-datasheet-96908606.pdf?src-supplier=Rs; ComponentLink6Description: http://datasheet.octopart.com/IPA60R120P7XKSA1-Infineon-datasheet-96908606.pdf?src-supplier=Rs; ComponentLink7URL: http://datasheet.octopart.com/IPA60R120P7XKSA1-Infineon-datasheet-96908606.pdf?src-supplier=Mouser; ComponentLink7Description: http://datasheet.octopart.com/IPA60R120P7XKSA1-Infineon-datasheet-96908606.pdf?src-supplier=Mouser; ComponentLink8URL: https://datasheet.octopart.com/IPA60R120P7XKSA1-Infineon-datasheet-96908606.pdf?src-supplier=TME; ComponentLink8Description: https://datasheet.octopart.com/IPA60R120P7XKSA1-Infineon-datasheet-96908606.pdf?src-supplier=TME; ComponentLink9URL: http://datasheet.octopart.com/IPA60R120P7XKSA1-Infineon-datasheet-96908606.pdf?src-supplier=Rochester+Electronics; ComponentLink9Description: http://datasheet.octopart.com/IPA60R120P7XKSA1-Infineon-datasheet-96908606.pdf?src-supplier=Rochester+Electronics
Q8 Q11 = BC858C-7-F: TRANS PNP 30V 0.1A SOT23-3; Manufacturer: Diodes; Item Type: BJTs; Supplier: Future Electronics; LCSC Part Number: C526469; Manufacturer Part Number: BC858C-7-F; RoHS: Yes; Stock: 69000; Pricing: 3000=0.021, 12000=0.0201, 30000=0.0195, 75000=0.0189, 120000=0.0181 (USD); ComponentLink1URL: https://datasheet.ciiva.com/22711/1911718-22711708.pdf?src-supplier=Element14; ComponentLink1Description: https://datasheet.ciiva.com/22711/1911718-22711708.pdf?src-supplier=Element14; ComponentLink2URL: https://datasheet.ciiva.com/11206/ds11207-11206007.pdf?src-supplier=Avnet; ComponentLink2Description: https://datasheet.ciiva.com/11206/ds11207-11206007.pdf?src-supplier=Avnet
Q12 = MMBT2222A-7-F: TRANS NPN 40V 0.6A SMD SOT23-3; Manufacturer: Diodes; Max Power Dissipation: 300mW; Collector Base Voltage (VCBO): 75V; Max Collector Current: 600mA; hFE Min: 100; Frequency: 300MHz; Number of Elements: 1; Emitter Base Voltage (VEBO): 6V; Collector Emitter Saturation Voltage: 1V; Power Dissipation: 350mW; Element Configuration: Single; Current: 1A; Item Type: Mosfet; Supplier 1: Digi-Key; Manufacturer Part Number: MMBT2222A-7-F; Stock 1: 2471182; Pricing 1: 1=0.15, 10=0.134, 100=0.0729, 500=0.04486, 1000=0.03059 (USD); Mount: Surface Mount; Case/Package: SOT-23; Number of Pins: 3; Weight: 0.000282oz; Contact Plating: Matte,Tin; Min Operating Temperature: -55°C; Max Operating Temperature: 150°C; Packaging: Tape and Reel; Collector Emitter Voltage (VCEO): 40V; Polarity: NPN; Voltage Rating (DC): 40V; Package Quantity: 3000; Continuous Collector Current: 600mA; Collector Emitter Breakdown Voltage: 40V; Transition Frequency: 300MHz; Max Breakdown Voltage: 40V; Max Frequency: 300MHz; Termination: SMD/SMT; Gain Bandwidth Product: 300MHz; Current Rating: 600mA; Voltage: 40V; Length: 3.05mm; Height: 1mm; Width: 1.4mm; Radiation Hardening: No; Lead Free: Lead Free; REACH SVHC: No SVHC; ComponentLink1URL: http://www.diodes.com/datasheets/ds30041.pdf?src-supplier=Future+Electronics; ComponentLink1Description: http://www.diodes.com/datasheets/ds30041.pdf?src-supplier=Future+Electronics; ComponentLink2URL: http://www.diodes.com/datasheets/ds30041.pdf?src-supplier=Avnet; ComponentLink2Description: http://www.diodes.com/datasheets/ds30041.pdf?src-supplier=Avnet; ComponentLink3URL: https://www.verical.com/server-webapp/html/getDatasheet?partID=82692&src-supplier=Verical; ComponentLink3Description: https://www.verical.com/server-webapp/html/getDatasheet?partID=82692&src-supplier=Verical; ComponentLink4URL: https://www.diodes.com/assets/Datasheets/ds30041.pdf?src-supplier=Digi-Key; ComponentLink4Description: https://www.diodes.com/assets/Datasheets/ds30041.pdf?src-supplier=Digi-Key; ComponentLink5URL: http://www.diodes.com/datasheets/ds30041.pdf?src-supplier=Avnet+Europe; ComponentLink5Description: http://www.diodes.com/datasheets/ds30041.pdf?src-supplier=Avnet+Europe; ComponentLink6URL: http://www.diodes.com/datasheets/ds30041.pdf?src-supplier=Element14; ComponentLink6Description: http://www.diodes.com/datasheets/ds30041.pdf?src-supplier=Element14; Supplier Part Number 1: MMBT2222A-FDIDKR-ND; LCSC Part Number: C94515
R38 = RT0603BRE076K8L: RES SMD 6.8K OHM 0.1% 1/10W 0603; Manufacturer: Yageo; Power: 100mW; Rated Temperature: 70°C; Value: 6.8kR; Temperature Coefficient: 50ppm/°C; Working Voltage: 75V; Package Height: 0.45mm; Package Length: 1.6mm; Package Width: 0.8mm; Item Type: Resistor; Supplier 1: Mouser; Manufacturer Part Number: RT0603BRE076K8L; RoHS: Yes; Category: Chip SMD Resistors; Stock 1: 1191; Pricing 1: 1=0.32000, 10=0.26800, 50=0.26800, 100=0.10500, 1000=0.04400, 10000=0.03600 (USD); Mounting Technology: Surface Mount; Pins: 2; Case/Package: 0603; Min Operating Temperature: -55°C; Max Operating Temperature: 155°C; Tolerance: 0.1%; Resistor Type: FIXED RESISTOR; Construction: Chip; Package Style: SMTMeter; Packaging: Tape and Reel; Technology: THIN FILM; Termination: Wraparound; Reach SVHC Compliant: Yes; RoHS Compliant: Yes; ComponentLink1URL: https://datasheet.ciiva.com:443/pdfs/VipMasterIC/IC/YAGO/YAGO-S-A0008510989/YAGO-S-A0008510989-1.pdf?src-supplier=IHS+Markit; ComponentLink1Description: https://datasheet.ciiva.com:443/pdfs/VipMasterIC/IC/YAGO/YAGO-S-A0008510989/YAGO-S-A0008510989-1.pdf?src-supplier=IHS+Markit; ComponentLink2URL: https://datasheet.ciiva.com/2584/pyu-rt-1-to-0-05-rohs-l-5-2584607.pdf?src-supplier=Digi-Key; ComponentLink2Description: https://datasheet.ciiva.com/2584/pyu-rt-1-to-0-05-rohs-l-5-2584607.pdf?src-supplier=Digi-Key; Supplier Part Number 1: 603-RT0603BRE076K8L; LCSC Part Number: C705876
R39 R50 = RC0603FR-074R7L: RES 4.7 OHM 1% 1/10W 0603; Manufacturer: Yageo; Voltage Rating: 50V; Power Rating: 100mW; Temperature Coefficient: 200ppm/°C; Item Type: Resistor; Supplier 1: Future Electronics; Manufacturer Part Number: RC0603FR-074R7L; RoHS: Yes; Category: Chip SMD Resistors; Stock 1: 160000; Pricing 1: 5000=0.0036, 25000=0.0034, 125000=0.0032, 250000=0.0031, 750000=0.0029 (USD); Case/Package: 0603; Pins: 2; Case Code (Imperial): 0603; Case Code (Metric): 1608; Min Operating Temperature: -55°C; Max Operating Temperature: 155°C; Package Quantity: 5000; Value: 4.7R; Tolerance: 1%; Packaging: Tape and Reel; Voltage Rating (DC): 50V; Resistor Type: Thick Film; Number of Terminations: 2; Termination: SMD/SMT; Max Power Dissipation: 100mW; Features: Moisture Resistant; Series: RC; Resistance Tolerance: 1%; Length: 1.6mm; Width: 0.8mm; Height: 0.45mm; Lead Free: Lead Free; Reach SVHC Compliant: Unknown; ComponentLink1URL: https://datasheet.ciiva.com/46440/1868787-46440910.pdf?src-supplier=Element14; ComponentLink1Description: https://datasheet.ciiva.com/46440/1868787-46440910.pdf?src-supplier=Element14; ComponentLink2URL: https://datasheet.ciiva.com/12555/rc0603-272842-12555071.pdf?src-supplier=Mouser; ComponentLink2Description: https://datasheet.ciiva.com/12555/rc0603-272842-12555071.pdf?src-supplier=Mouser; Supplier Part Number 1: 3598901; LCSC Part Number: C137705
R40 R44 R75 R76 = CRCW080510R0FKEAHP: RES SMD 10 OHM 1% 1/2W 0805; Manufacturer: Vishay; Item Type: Resistor; Power Rating: 330mW; Voltage Rating: 150V; Temperature Coefficient: 100ppm/°C; Max Power Dissipation: 333mW; Supplier: Mouser; LCSC Part Number: C844598; Manufacturer Part Number: CRCW080510R0FKEAHP; RoHS: Yes; Stock: 384044; Pricing: 1=0.19, 10=0.066, 50=0.066, 100=0.04, 1000=0.027, 10000=0.023 (USD); Case/Package: 0805; Weight: 0.000194oz; Case Code (Imperial): 0805; Case Code (Metric): 2012; Contact Plating: Tin; Min Operating Temperature: -55°C; Max Operating Temperature: 155°C; Value: 10R; Tolerance: 1%; Packaging: Tape and Reel; Package Quantity: 5000; Resistor Type: Thick Film; Termination: SMD/SMT; Voltage Rating (DC): 150V; Features: Automotive AEC-Q200; Series: CRCW-HP; Number of Terminations: 2; Resistance Tolerance: 1%; Technology: THICK FILM; Construction: Rectangular; Length: 2mm; Width: 1.2mm; Height: 0.5mm; Depth: 1.25mm; Ratings: AEC-Q200; Radiation Hardening: No; Military Standard: Not; Lead Free: Lead Free; RoHS Compliant: Yes; Reach SVHC Compliant: Unknown; ComponentLink1URL: http://www.farnell.com/datasheets/2884039.pdf?src-supplier=Newark; ComponentLink1Description: http://www.farnell.com/datasheets/2884039.pdf?src-supplier=Newark; ComponentLink2URL: https://datasheet.octopart.com/CRCW080510R0FKEAHP-Vishay-datasheet-87136057.pdf?src-supplier=Newark; ComponentLink2Description: https://datasheet.octopart.com/CRCW080510R0FKEAHP-Vishay-datasheet-87136057.pdf?src-supplier=Newark; ComponentLink3URL: http://www.vishay.com/docs/20043/crcwhpe3.pdf?src-supplier=Digikey; ComponentLink3Description: http://www.vishay.com/docs/20043/crcwhpe3.pdf?src-supplier=Digikey
R41 R45 = RC0603FR-0722RL: RES 22 OHM 1% 1/10W 0603; Manufacturer: Yageo; Temperature Coefficient: 100ppm/°C; Voltage Rating (DC): 50V; Power Rating: 100mW; Item Type: Resistor; Supplier 1: Avnet; Manufacturer Part Number: RC0603FR-0722RL; RoHS: Yes; Category: Chip SMD Resistors; Stock 1: 190000; Pricing 1: 5000=0.00133, 10000=0.00131, 20000=0.00127 (USD); Case/Package: 0603; Number of Pins: 2; Case Code (Metric): 1608; Case Code (Imperial): 0603; Size Code: 0603; Min Operating Temperature: -55°C; Max Operating Temperature: 155°C; Tolerance: 1%; Resistance: 22R; Resistor Type: Thick Film; Packaging: Tape and Reel; Voltage Rating: 50V; Package Quantity: 1; Number of Terminations: 2; Termination: SMD/SMT; Max Power Dissipation: 100mW; Features: Moisture Resistant; Series: RC; Resistance Tolerance: 1%; Technology: THICK FILM; Construction: Rectangular; Length: 0.063inch; Width: 0.031inch; Height: 0.022inch; Depth: 0.8mm; Reach SVHC Compliant: Yes; Lead Free: Lead Free; Military Standard: Not; RoHS Compliant: Yes; ComponentLink1URL: https://datasheet.ciiva.com/11819/0900766b80f96399-11819285.pdf?src-supplier=RSComponents; ComponentLink1Description: https://datasheet.ciiva.com/11819/0900766b80f96399-11819285.pdf?src-supplier=RSComponents; ComponentLink2URL: https://datasheet.ciiva.com/46395/443971-46395032.pdf?src-supplier=Element14; ComponentLink2Description: https://datasheet.ciiva.com/46395/443971-46395032.pdf?src-supplier=Element14; ComponentLink3URL: https://datasheet.ciiva.com/46440/1868787-46440901.pdf?src-supplier=Element14; ComponentLink3Description: https://datasheet.ciiva.com/46440/1868787-46440901.pdf?src-supplier=Element14; ComponentLink4URL: https://datasheet.ciiva.com/2454/pyu-r-int-thick-7-2454355.pdf?src-supplier=Digi-Key; ComponentLink4Description: https://datasheet.ciiva.com/2454/pyu-r-int-thick-7-2454355.pdf?src-supplier=Digi-Key; ComponentLink5URL: https://datasheet.ciiva.com/2454/pyu-r-int-thick-7-2454356.pdf?src-supplier=Digi-Key; ComponentLink5Description: https://datasheet.ciiva.com/2454/pyu-r-int-thick-7-2454356.pdf?src-supplier=Digi-Key; ComponentLink6URL: https://datasheet.ciiva.com/2454/pyu-r-int-thick-7-2454354.pdf?src-supplier=Digi-Key; ComponentLink6Description: https://datasheet.ciiva.com/2454/pyu-r-int-thick-7-2454354.pdf?src-supplier=Digi-Key; Supplier Part Number 1: RC0603FR-0722RL; LCSC Part Number: C107701
R42 R47 = RC0603FR-074K7L: RES SMD 4.7K OHM 1% 1/10W 0603; Manufacturer: Yageo; Item Type: Resistor; Manufacturer Part Number: RC0603FR-074K7L; Package: 0603; ComponentLink7Description: LCSC; ComponentLink7URL: https://www.lcsc.com/product-detail/Chip-Resistor-Surface-Mount_YAGEO-RC0603FR-074K7L_C99782.html; LCSC Part Number: C99782
R43 = PA2512FKF7T0U5E: METAL CURRENT SENSOR 2512 1% 100; Manufacturer: Yageo; Item Type: Resistors; Power Rating: 3W; Temperature Coefficient: 100ppm/°C; Supplier: Avnet; LCSC Part Number: PA2512FKF7T0U5E; Manufacturer Part Number: PA2512FKF7T0U5E; RoHS: Yes; Stock: 12000; Pricing: 4000=0.23986 (USD); Case/Package: 348Case; Min Operating Temperature: -55°C; Max Operating Temperature: 170°C; Tolerance: 1%; Height: 880um; ComponentLink1URL: https://www.yageo.com/upload/media/product/productsearch/datasheet/rchip/PYu-PA_E_51_RoHS_10.pdf?src-supplier=Digikey; ComponentLink1Description: https://www.yageo.com/upload/media/product/productsearch/datasheet/rchip/PYu-PA_E_51_RoHS_10.pdf?src-supplier=Digikey; ComponentLink2URL: https://datasheet.octopart.com/PA2512FKF7T0U5E-Yageo-datasheet-137700559.pdf?src-supplier=Future+Electronics; ComponentLink2Description: https://datasheet.octopart.com/PA2512FKF7T0U5E-Yageo-datasheet-137700559.pdf?src-supplier=Future+Electronics
R46 = RT0603BRD0759K7L: RES SMD 59.7KOHM 0.1% 1/10W 0603; Manufacturer: Yageo; Item Type: Resistors; Value: 59.7kR; Max Power Dissipation: 100mW; Temperature Coefficient: 25ppm/°C; Supplier: Mouser; LCSC Part Number: C861481; Manufacturer Part Number: RT0603BRD0759K7L; RoHS: Yes; Stock: 8235; Pricing: 1=0.14, 10=0.104, 50=0.083, 100=0.074, 1000=0.05, 10000=0.032 (USD); Case/Package: 0603; Min Operating Temperature: -55°C; Max Operating Temperature: 155°C; Packaging: Tape and Reel; Number of Terminations: 2; Tolerance: 0.1%; Features: Moisture Resistant; Series: RT; Length: 0.063inch; Width: 0.031inch; Height: 0.022inch; RoHS Compliant: Yes; ComponentLink1URL: http://www.yageo.com/documents/recent/PYu-RT_1-to-0.01_RoHS_L_8.pdf?src-supplier=Digikey; ComponentLink1Description: http://www.yageo.com/documents/recent/PYu-RT_1-to-0.01_RoHS_L_8.pdf?src-supplier=Digikey